# Altium schematic sheet SERIAL-CHIP.SchDoc
size A4; SheetNumber: 4; SheetTotal: 6
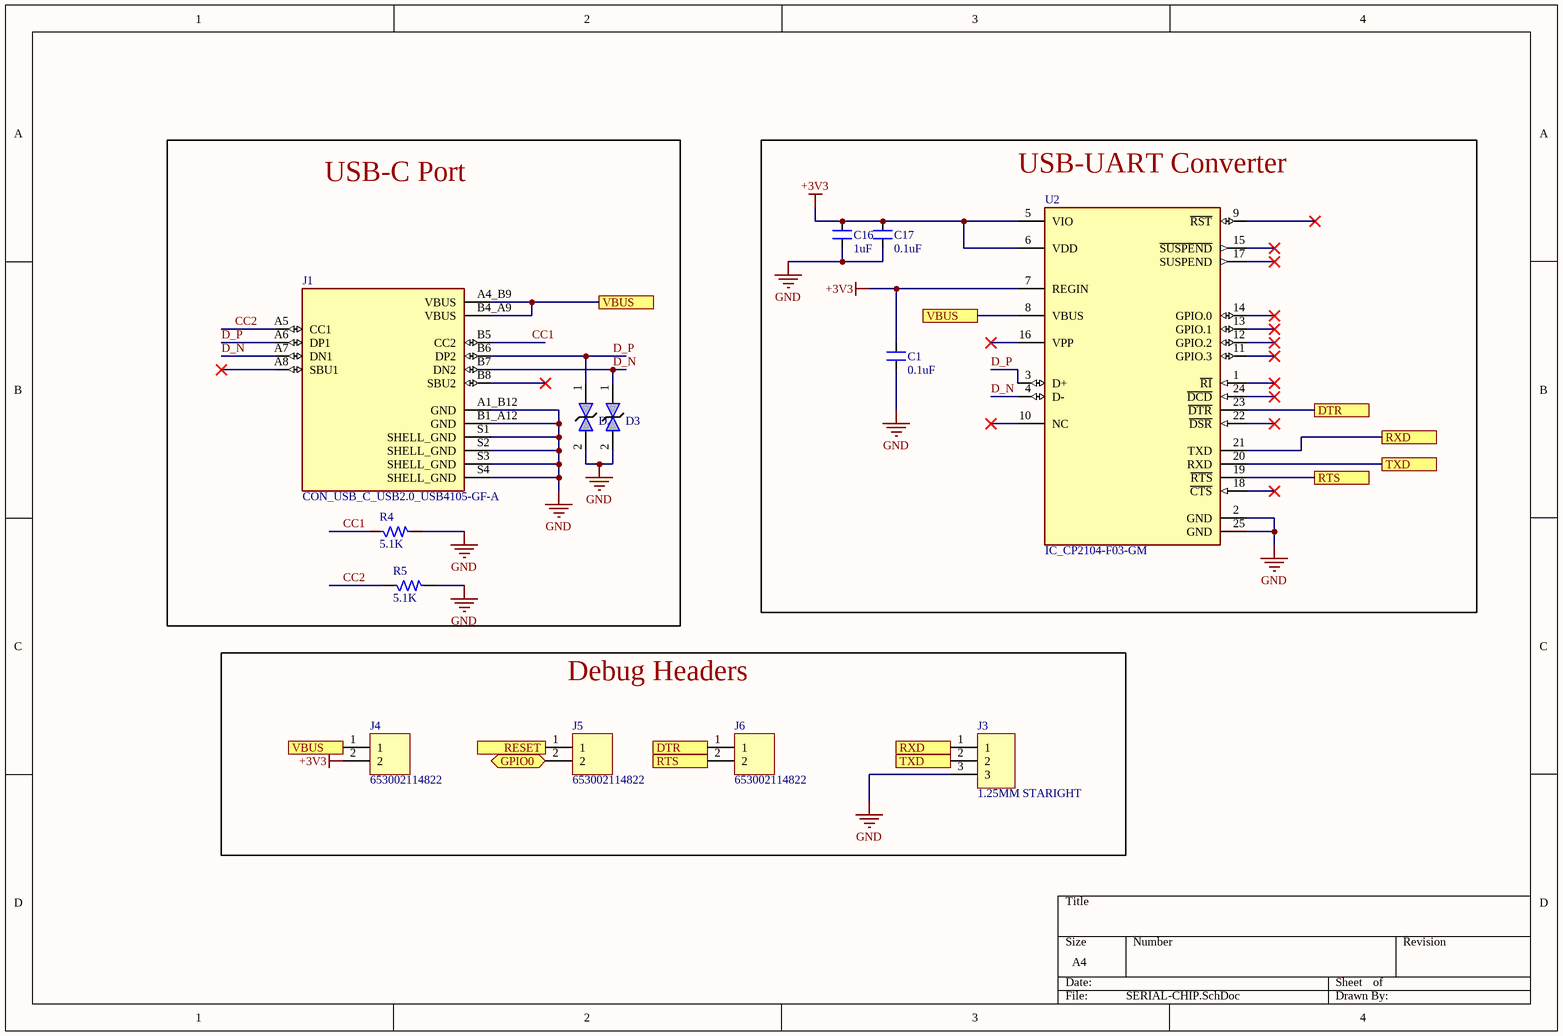
[diagram p0: SERIAL-CHIP.SchDoc]

## Parts
C1  0.1uF  [CAP_0805]
C16  1uF  [CAP_0805]
C17  0.1uF  [CAP_0805]
D2  DIO-TVS-4V-LXES15AAA1-153  [Murata_LXES15_IPC_A]  (value not drawn)
D3  DIO-TVS-4V-LXES15AAA1-153  [Murata_LXES15_IPC_A]  (value not drawn)
J1  CON_USB_C_USB2.0_USB4105-GF-A  [CON_USB_C_USB2.0_USB4105-GF-A]
J3  1.25MM STARIGHT  [CON3_probing_1.25mm]
J4  653002114822  [CON2_probing_1.25mm]
J5  653002114822  [CON2_probing_1.25mm]
J6  653002114822  [CON2_probing_1.25mm]
R4  5.1K  [RES_0805]
R5  5.1K  [RES_0805]
U2  IC_CP2104-F03-GM  [CP2104-F03-GM]

## Blocks framed on the sheet
USB-C Port: D2 D3 J1 R4 R5
USB-UART Converter: C1 C16 C17 U2
Debug Headers: J3-J6

## Ports
DTR, GPIO0 (bidir), RESET, RTS, RXD, TXD, VBUS

## Nets
+3V3: C1.2 C16.2 C17.2 J4.2 U2.5(VIO) U2.6(VDD) U2.7(REGIN)
GND: C1.1 C16.1 C17.1 D2.2 D3.2 J1.A1_B12(GND) J1.B1_A12(GND) J1.S1(SHELL_GND) J1.S2(SHELL_GND) J1.S3(SHELL_GND) J1.S4(SHELL_GND) J3.3 R4.2 R5.2 U2.2(GND) U2.25(GND)
CC1: J1.B5(CC2) R4.1
CC2: J1.A5(CC1) R5.1
D_N: D3.1 J1.A7(DN1) J1.B7(DN2) U2.4(D-)
D_P: D2.1 J1.A6(DP1) J1.B6(DP2) U2.3(D+)
DTR: J6.1 U2.23(~{DTR}) ; port DTR
GPIO0: J5.2 ; port GPIO0
RESET: J5.1 ; port RESET
RTS: J6.2 U2.19(~{RTS}) ; port RTS
RXD: J3.1 U2.21(TXD) ; port RXD
TXD: J3.2 U2.20(RXD) ; port TXD
VBUS: J1.A4_B9(VBUS) J1.B4_A9(VBUS) J4.1 U2.8(VBUS) ; port VBUS

Not connected (* = marked no-connect by the designer): J1 A8(SBU1)* B8(SBU2)*; U2 1(~{RI})* 9(~{RST})* 10(NC)* 11(GPIO.3)* 12(GPIO.2)* 13(GPIO.1)* 14(GPIO.0)* 15(~{SUSPEND})* 16(VPP)* 17(SUSPEND)* 18(~{CTS})* 22(~{DSR})* 24(~{DCD})*

## Library data of the parts
C1 C17 = CAP_0.1uF-50V-10%-0805: 0.1µF ±10% 50V Ceramic Capacitor X7R 0805 (2012 Metric); Manufacturer: Samsung; Manufacturer Part Number: CL21B104KBCNNNC; Alternate Part Number-1: NA; Case/Package: 0805; Supplier-1: SIRICOM; Supplier Part Number-1: 0805B104K500CT
C16 = CAP_1uF-50V-10%-0805_1: 1µF ±10% 50V Ceramic Capacitor X7R 0805 (2012 Metric); Manufacturer: Samsung; Manufacturer Part Number: CL21B104KBCNNNC; Alternate Part Number-1: NA; Case/Package: 0805; Supplier-1: SIRICOM; Supplier Part Number-1: 0805B104K500CT
D2 D3 = DIO-TVS-4V-LXES15AAA1-153: ESD Suppressor Diode TVS Bi-Dir 4V 2-Pin Case 0402(1005Metric) T/R
J3 = CON-3-1.25MM-PROBING: 3 Pins, 1 Row 1.25mm Pitch, straight Connector, male; Manufacturer Part Number: 653003114822; Manufacturer: WURTH; Mating Part Number: 653003113322; Crimp Part Number: 653153128130; Alternate Part Number-1: NA; Case/Package: TH-CON; Supplier-1: WURTH; Supplier Part Number-1: 653003114822
J4-J6 = CON-2-1.25MM-PROPING: 2 Pins, 1 Row 1.25mm Pitch, Straight Connector, male; Manufacturer: JST; Mating Part Number: 653002113322; Crimp Part Number: 653153128130; Alternate Part Number-1: NA; Manufacturer Part Number: 653002114822; Case/Package: TH-CON; Supplier-1: WURTH; Supplier Part Number-1: 653002114822
R4 R5 = RES_5.1K-0.125W-1%-0805: 5.1 kOhms ±1% 0.125W, 1/8W Chip Resistor 0805 (2012 Metric) Moisture Resistant Thick Film; Manufacturer: Stackpole Electronics; Manufacturer Part Number: RC0805FR-075K9L; Alternate Part Number-1: NA; Case/Package: 0805; Supplier-1: SIRICOM; Supplier Part Number-1: WR08X5901FTL